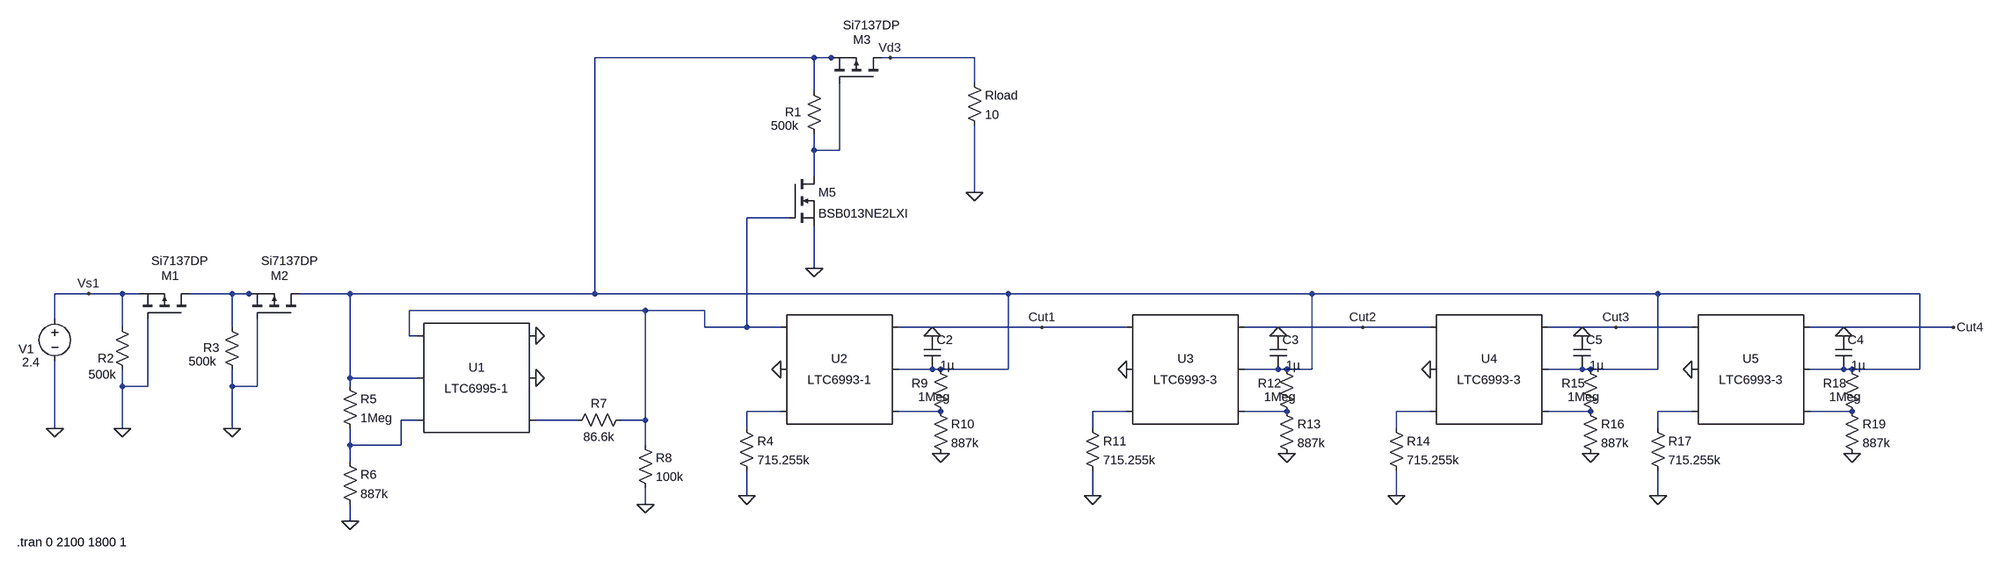
[diagram p0: schematic Timer.asc]
Timer.asc, the LTspice schematic file:
Version 4
SHEET 1 3272 1220
WIRE 320 -368 -96 -368
WIRE 352 -368 320 -368
WIRE 368 -368 352 -368
WIRE 464 -368 448 -368
WIRE 624 -368 464 -368
WIRE 624 -320 624 -368
WIRE 320 -304 320 -368
WIRE 320 -192 320 -224
WIRE 368 -192 368 -320
WIRE 368 -192 320 -192
WIRE 320 -144 320 -192
WIRE 624 -112 624 -240
WIRE 272 -64 192 -64
WIRE 320 32 320 -48
WIRE -1056 80 -1120 80
WIRE -992 80 -1056 80
WIRE -960 80 -992 80
WIRE -784 80 -864 80
WIRE -752 80 -784 80
WIRE -736 80 -752 80
WIRE -560 80 -656 80
WIRE -96 80 -96 -368
WIRE -96 80 -560 80
WIRE 688 80 -96 80
WIRE 1264 80 688 80
WIRE 1920 80 1264 80
WIRE 2416 80 1920 80
WIRE 0 112 -448 112
WIRE 112 112 0 112
WIRE -1120 128 -1120 80
WIRE -992 144 -992 80
WIRE -784 144 -784 80
WIRE 112 144 112 112
WIRE 192 144 192 -64
WIRE 192 144 112 144
WIRE 256 144 192 144
WIRE 752 144 480 144
WIRE 912 144 752 144
WIRE 1360 144 1136 144
WIRE 1488 144 1360 144
WIRE 1840 144 1712 144
WIRE 1984 144 1840 144
WIRE 2480 144 2208 144
WIRE -448 160 -448 112
WIRE -432 160 -448 160
WIRE 544 224 480 224
WIRE 560 224 544 224
WIRE 688 224 688 80
WIRE 688 224 560 224
WIRE 1200 224 1136 224
WIRE 1216 224 1200 224
WIRE 1264 224 1264 80
WIRE 1264 224 1216 224
WIRE 1776 224 1712 224
WIRE 1792 224 1776 224
WIRE 1920 224 1920 80
WIRE 1920 224 1792 224
WIRE 2272 224 2208 224
WIRE 2288 224 2272 224
WIRE 2416 224 2416 80
WIRE 2416 224 2288 224
WIRE -560 240 -560 80
WIRE -432 240 -560 240
WIRE -992 256 -992 224
WIRE -944 256 -944 128
WIRE -944 256 -992 256
WIRE -784 256 -784 224
WIRE -736 256 -736 128
WIRE -736 256 -784 256
WIRE -560 256 -560 240
WIRE 256 304 192 304
WIRE 560 304 480 304
WIRE 912 304 848 304
WIRE 1216 304 1136 304
WIRE 1488 304 1424 304
WIRE 1792 304 1712 304
WIRE 1984 304 1920 304
WIRE 2288 304 2208 304
WIRE -432 320 -464 320
WIRE -128 320 -208 320
WIRE 0 320 0 112
WIRE 0 320 -48 320
WIRE -1120 336 -1120 208
WIRE -992 336 -992 256
WIRE -784 336 -784 256
WIRE 192 336 192 304
WIRE 848 336 848 304
WIRE 1424 336 1424 304
WIRE 1920 336 1920 304
WIRE -560 368 -560 336
WIRE -464 368 -464 320
WIRE -464 368 -560 368
WIRE 0 368 0 320
WIRE -560 400 -560 368
WIRE 192 464 192 416
WIRE 848 464 848 416
WIRE 1424 464 1424 416
WIRE 1920 464 1920 416
WIRE 0 480 0 448
WIRE -560 512 -560 480
FLAG -992 336 0
FLAG -784 336 0
FLAG -1120 336 0
FLAG -1056 80 Vs1
FLAG 464 -368 Vd3
FLAG 624 -112 0
FLAG -560 512 0
FLAG -208 240 0
FLAG -208 160 0
FLAG 0 480 0
FLAG 320 32 0
FLAG 256 224 0
FLAG 192 464 0
FLAG 560 384 0
FLAG 544 160 0
FLAG 912 224 0
FLAG 848 464 0
FLAG 1216 384 0
FLAG 1200 160 0
FLAG 1488 224 0
FLAG 1424 464 0
FLAG 1792 384 0
FLAG 1776 160 0
FLAG 1984 224 0
FLAG 1920 464 0
FLAG 2288 384 0
FLAG 2272 160 0
FLAG 752 144 Cut1
FLAG 1360 144 Cut2
FLAG 1840 144 Cut3
FLAG 2480 144 Cut4
SYMBOL voltage -1120 112 R0
WINDOW 0 -69 73 Left 2
WINDOW 3 -62 98 Left 2
WINDOW 123 0 0 Left 0
WINDOW 39 0 0 Left 0
SYMATTR InstName V1
SYMATTR Value 2.4
SYMBOL res -1008 128 R0
WINDOW 0 -31 75 Left 2
WINDOW 3 -48 106 Left 2
SYMATTR InstName R2
SYMATTR Value 500k
SYMBOL res -800 128 R0
WINDOW 0 -39 55 Left 2
WINDOW 3 -66 81 Left 2
SYMATTR InstName R3
SYMATTR Value 500k
SYMBOL pmos -864 128 M270
WINDOW 0 82 54 VLeft 2
WINDOW 3 110 73 VLeft 2
SYMATTR InstName M1
SYMATTR Value Si7137DP
SYMBOL pmos -656 128 M270
WINDOW 0 82 54 VLeft 2
WINDOW 3 110 73 VLeft 2
SYMATTR InstName M2
SYMATTR Value Si7137DP
SYMBOL res 304 -320 R0
WINDOW 0 -39 55 Left 2
WINDOW 3 -66 81 Left 2
SYMATTR InstName R1
SYMATTR Value 500k
SYMBOL pmos 448 -320 M270
WINDOW 0 82 54 VLeft 2
WINDOW 3 110 73 VLeft 2
SYMATTR InstName M3
SYMATTR Value Si7137DP
SYMBOL res 608 -336 R0
SYMATTR InstName Rload
SYMATTR Value 10
SYMBOL SpecialFunctions\\LTC6995-1 -320 240 M0
SYMATTR InstName U1
SYMBOL res -576 240 R0
SYMATTR InstName R5
SYMATTR Value 1Meg
SYMBOL res -576 384 R0
SYMATTR InstName R6
SYMATTR Value 887k
SYMBOL res -32 304 R90
WINDOW 0 0 56 VBottom 2
WINDOW 3 32 56 VTop 2
SYMATTR InstName R7
SYMATTR Value 86.6k
SYMBOL res -16 352 R0
SYMATTR InstName R8
SYMATTR Value 100k
SYMBOL nmos 272 -144 R0
SYMATTR InstName M5
SYMATTR Value BSB013NE2LXI
SYMBOL SpecialFunctions\\LTC6993-1 368 224 R0
SYMATTR InstName U2
SYMBOL res 176 320 R0
SYMATTR InstName R4
SYMATTR Value 715.255k
SYMBOL res 544 208 R0
WINDOW 0 -39 42 Left 2
WINDOW 3 -27 68 Left 2
SYMATTR InstName R9
SYMATTR Value 1Meg
SYMBOL res 544 288 R0
SYMATTR InstName R10
SYMATTR Value 887k
SYMBOL cap 528 160 R0
SYMATTR InstName C2
SYMATTR Value .1µ
SYMBOL res 832 320 R0
SYMATTR InstName R11
SYMATTR Value 715.255k
SYMBOL res 1200 208 R0
WINDOW 0 -39 42 Left 2
WINDOW 3 -27 68 Left 2
SYMATTR InstName R12
SYMATTR Value 1Meg
SYMBOL res 1200 288 R0
SYMATTR InstName R13
SYMATTR Value 887k
SYMBOL cap 1184 160 R0
SYMATTR InstName C3
SYMATTR Value .1µ
SYMBOL SpecialFunctions\\LTC6993-3 1024 224 R0
SYMATTR InstName U3
SYMBOL res 1408 320 R0
SYMATTR InstName R14
SYMATTR Value 715.255k
SYMBOL res 1776 208 R0
WINDOW 0 -39 42 Left 2
WINDOW 3 -27 68 Left 2
SYMATTR InstName R15
SYMATTR Value 1Meg
SYMBOL res 1776 288 R0
SYMATTR InstName R16
SYMATTR Value 887k
SYMBOL cap 1760 160 R0
SYMATTR InstName C5
SYMATTR Value .1µ
SYMBOL SpecialFunctions\\LTC6993-3 1600 224 R0
SYMATTR InstName U4
SYMBOL res 1904 320 R0
SYMATTR InstName R17
SYMATTR Value 715.255k
SYMBOL res 2272 208 R0
WINDOW 0 -39 42 Left 2
WINDOW 3 -27 68 Left 2
SYMATTR InstName R18
SYMATTR Value 1Meg
SYMBOL res 2272 288 R0
SYMATTR InstName R19
SYMATTR Value 887k
SYMBOL cap 2256 160 R0
SYMATTR InstName C4
SYMATTR Value .1µ
SYMBOL SpecialFunctions\\LTC6993-3 2096 224 R0
SYMATTR InstName U5
TEXT -1192 552 Left 2 !.tran 0 2100 1800 1

The netlist it stands for:
* Timer.asc
V1 Vs1 0 2.4
R2 Vs1 0 500k
R3 N004 0 500k
M1 N004 0 Vs1 Vs1 Si7137DP
M2 N001 0 N004 N004 Si7137DP
R1 N001 N002 500k
M3 Vd3 N002 N001 N001 Si7137DP
Rload Vd3 0 10
XU1 0 0 N014 N013 N001 N003 LTC6995-1
R5 N001 N013 1Meg
R6 N013 0 887k
R7 N003 N014 86.6k
R8 N003 0 100k
M5 N002 N003 0 0 BSB013NE2LXI
XU2 N003 0 N005 N006 N001 Cut1 LTC6993-1
R4 N005 0 715.255k
R9 N001 N006 1Meg
R10 N006 0 887k
C2 0 N001 .1µ
R11 N007 0 715.255k
R12 N001 N008 1Meg
R13 N008 0 887k
C3 0 N001 .1µ
XU3 Cut1 0 N007 N008 N001 Cut2 LTC6993-3
R14 N009 0 715.255k
R15 N001 N010 1Meg
R16 N010 0 887k
C5 0 N001 .1µ
XU4 Cut2 0 N009 N010 N001 Cut3 LTC6993-3
R17 N011 0 715.255k
R18 N001 N012 1Meg
R19 N012 0 887k
C4 0 N001 .1µ
XU5 Cut3 0 N011 N012 N001 Cut4 LTC6993-3
.model NMOS NMOS
.model PMOS PMOS
.lib standard.mos
.tran 0 2100 1800 1
.lib LTC6995-1.sub
.lib LTC6993-3.sub
.backanno
.end